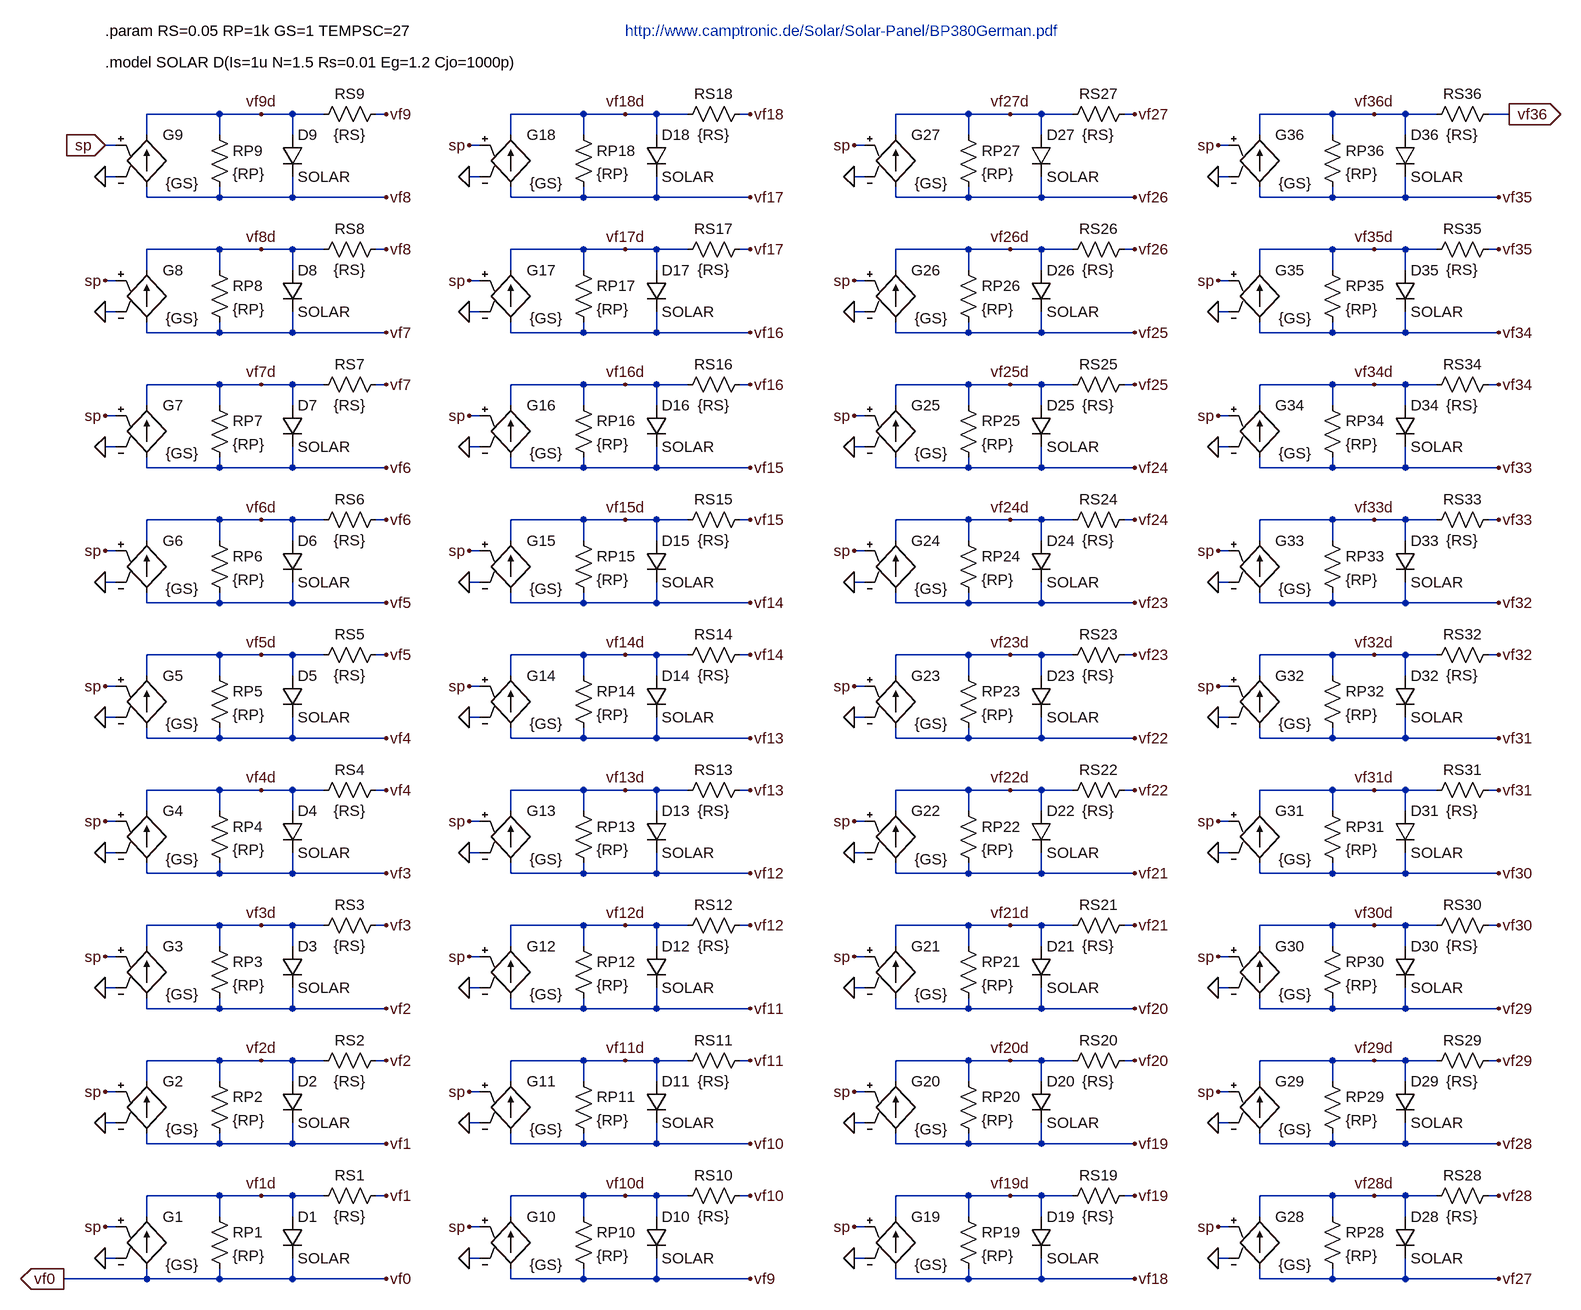
[diagram p0: schematic solar36.asc]
solar36.asc, the LTspice schematic file:
Version 4
SHEET 1 2152 2104
WIRE -1168 240 -1280 240
WIRE -1104 240 -1168 240
WIRE -1056 240 -1104 240
WIRE -1008 240 -1056 240
WIRE -912 240 -928 240
WIRE -608 240 -720 240
WIRE -544 240 -608 240
WIRE -496 240 -544 240
WIRE -448 240 -496 240
WIRE -352 240 -368 240
WIRE -16 240 -128 240
WIRE 48 240 -16 240
WIRE 96 240 48 240
WIRE 144 240 96 240
WIRE 240 240 224 240
WIRE 544 240 432 240
WIRE 608 240 544 240
WIRE 656 240 608 240
WIRE 704 240 656 240
WIRE 816 240 784 240
WIRE -1280 272 -1280 240
WIRE -1168 272 -1168 240
WIRE -1056 272 -1056 240
WIRE -720 272 -720 240
WIRE -608 272 -608 240
WIRE -496 272 -496 240
WIRE -128 272 -128 240
WIRE -16 272 -16 240
WIRE 96 272 96 240
WIRE 432 272 432 240
WIRE 544 272 544 240
WIRE 656 272 656 240
WIRE -1328 288 -1344 288
WIRE -768 288 -784 288
WIRE -176 288 -192 288
WIRE 384 288 368 288
WIRE -1328 336 -1344 336
WIRE -768 336 -784 336
WIRE -176 336 -192 336
WIRE 384 336 368 336
WIRE -1280 368 -1280 352
WIRE -1168 368 -1168 352
WIRE -1168 368 -1280 368
WIRE -1056 368 -1056 336
WIRE -1056 368 -1168 368
WIRE -912 368 -1056 368
WIRE -720 368 -720 352
WIRE -608 368 -608 352
WIRE -608 368 -720 368
WIRE -496 368 -496 336
WIRE -496 368 -608 368
WIRE -352 368 -496 368
WIRE -128 368 -128 352
WIRE -16 368 -16 352
WIRE -16 368 -128 368
WIRE 96 368 96 336
WIRE 96 368 -16 368
WIRE 240 368 96 368
WIRE 432 368 432 352
WIRE 544 368 544 352
WIRE 544 368 432 368
WIRE 656 368 656 336
WIRE 656 368 544 368
WIRE 800 368 656 368
WIRE -1168 448 -1280 448
WIRE -1104 448 -1168 448
WIRE -1056 448 -1104 448
WIRE -1008 448 -1056 448
WIRE -912 448 -928 448
WIRE -608 448 -720 448
WIRE -544 448 -608 448
WIRE -496 448 -544 448
WIRE -448 448 -496 448
WIRE -352 448 -368 448
WIRE -16 448 -128 448
WIRE 48 448 -16 448
WIRE 96 448 48 448
WIRE 144 448 96 448
WIRE 240 448 224 448
WIRE 544 448 432 448
WIRE 608 448 544 448
WIRE 656 448 608 448
WIRE 704 448 656 448
WIRE 800 448 784 448
WIRE -1280 480 -1280 448
WIRE -1168 480 -1168 448
WIRE -1056 480 -1056 448
WIRE -720 480 -720 448
WIRE -608 480 -608 448
WIRE -496 480 -496 448
WIRE -128 480 -128 448
WIRE -16 480 -16 448
WIRE 96 480 96 448
WIRE 432 480 432 448
WIRE 544 480 544 448
WIRE 656 480 656 448
WIRE -1328 496 -1344 496
WIRE -768 496 -784 496
WIRE -176 496 -192 496
WIRE 384 496 368 496
WIRE -1328 544 -1344 544
WIRE -768 544 -784 544
WIRE -176 544 -192 544
WIRE 384 544 368 544
WIRE -1280 576 -1280 560
WIRE -1168 576 -1168 560
WIRE -1168 576 -1280 576
WIRE -1056 576 -1056 544
WIRE -1056 576 -1168 576
WIRE -912 576 -1056 576
WIRE -720 576 -720 560
WIRE -608 576 -608 560
WIRE -608 576 -720 576
WIRE -496 576 -496 544
WIRE -496 576 -608 576
WIRE -352 576 -496 576
WIRE -128 576 -128 560
WIRE -16 576 -16 560
WIRE -16 576 -128 576
WIRE 96 576 96 544
WIRE 96 576 -16 576
WIRE 240 576 96 576
WIRE 432 576 432 560
WIRE 544 576 544 560
WIRE 544 576 432 576
WIRE 656 576 656 544
WIRE 656 576 544 576
WIRE 800 576 656 576
WIRE -1168 656 -1280 656
WIRE -1104 656 -1168 656
WIRE -1056 656 -1104 656
WIRE -1008 656 -1056 656
WIRE -912 656 -928 656
WIRE -608 656 -720 656
WIRE -544 656 -608 656
WIRE -496 656 -544 656
WIRE -448 656 -496 656
WIRE -352 656 -368 656
WIRE -16 656 -128 656
WIRE 48 656 -16 656
WIRE 96 656 48 656
WIRE 144 656 96 656
WIRE 240 656 224 656
WIRE 544 656 432 656
WIRE 608 656 544 656
WIRE 656 656 608 656
WIRE 704 656 656 656
WIRE 800 656 784 656
WIRE -1280 688 -1280 656
WIRE -1168 688 -1168 656
WIRE -1056 688 -1056 656
WIRE -720 688 -720 656
WIRE -608 688 -608 656
WIRE -496 688 -496 656
WIRE -128 688 -128 656
WIRE -16 688 -16 656
WIRE 96 688 96 656
WIRE 432 688 432 656
WIRE 544 688 544 656
WIRE 656 688 656 656
WIRE -1328 704 -1344 704
WIRE -768 704 -784 704
WIRE -176 704 -192 704
WIRE 384 704 368 704
WIRE -1328 752 -1344 752
WIRE -768 752 -784 752
WIRE -176 752 -192 752
WIRE 384 752 368 752
WIRE -1280 784 -1280 768
WIRE -1168 784 -1168 768
WIRE -1168 784 -1280 784
WIRE -1056 784 -1056 752
WIRE -1056 784 -1168 784
WIRE -912 784 -1056 784
WIRE -720 784 -720 768
WIRE -608 784 -608 768
WIRE -608 784 -720 784
WIRE -496 784 -496 752
WIRE -496 784 -608 784
WIRE -352 784 -496 784
WIRE -128 784 -128 768
WIRE -16 784 -16 768
WIRE -16 784 -128 784
WIRE 96 784 96 752
WIRE 96 784 -16 784
WIRE 240 784 96 784
WIRE 432 784 432 768
WIRE 544 784 544 768
WIRE 544 784 432 784
WIRE 656 784 656 752
WIRE 656 784 544 784
WIRE 800 784 656 784
WIRE -1168 864 -1280 864
WIRE -1104 864 -1168 864
WIRE -1056 864 -1104 864
WIRE -1008 864 -1056 864
WIRE -912 864 -928 864
WIRE -608 864 -720 864
WIRE -544 864 -608 864
WIRE -496 864 -544 864
WIRE -448 864 -496 864
WIRE -352 864 -368 864
WIRE -16 864 -128 864
WIRE 48 864 -16 864
WIRE 96 864 48 864
WIRE 144 864 96 864
WIRE 240 864 224 864
WIRE 544 864 432 864
WIRE 608 864 544 864
WIRE 656 864 608 864
WIRE 704 864 656 864
WIRE 800 864 784 864
WIRE -1280 896 -1280 864
WIRE -1168 896 -1168 864
WIRE -1056 896 -1056 864
WIRE -720 896 -720 864
WIRE -608 896 -608 864
WIRE -496 896 -496 864
WIRE -128 896 -128 864
WIRE -16 896 -16 864
WIRE 96 896 96 864
WIRE 432 896 432 864
WIRE 544 896 544 864
WIRE 656 896 656 864
WIRE -1328 912 -1344 912
WIRE -768 912 -784 912
WIRE -176 912 -192 912
WIRE 384 912 368 912
WIRE -1328 960 -1344 960
WIRE -768 960 -784 960
WIRE -176 960 -192 960
WIRE 384 960 368 960
WIRE -1280 992 -1280 976
WIRE -1168 992 -1168 976
WIRE -1168 992 -1280 992
WIRE -1056 992 -1056 960
WIRE -1056 992 -1168 992
WIRE -912 992 -1056 992
WIRE -720 992 -720 976
WIRE -608 992 -608 976
WIRE -608 992 -720 992
WIRE -496 992 -496 960
WIRE -496 992 -608 992
WIRE -352 992 -496 992
WIRE -128 992 -128 976
WIRE -16 992 -16 976
WIRE -16 992 -128 992
WIRE 96 992 96 960
WIRE 96 992 -16 992
WIRE 240 992 96 992
WIRE 432 992 432 976
WIRE 544 992 544 976
WIRE 544 992 432 992
WIRE 656 992 656 960
WIRE 656 992 544 992
WIRE 800 992 656 992
WIRE -1168 1072 -1280 1072
WIRE -1104 1072 -1168 1072
WIRE -1056 1072 -1104 1072
WIRE -1008 1072 -1056 1072
WIRE -912 1072 -928 1072
WIRE -608 1072 -720 1072
WIRE -544 1072 -608 1072
WIRE -496 1072 -544 1072
WIRE -448 1072 -496 1072
WIRE -352 1072 -368 1072
WIRE -16 1072 -128 1072
WIRE 48 1072 -16 1072
WIRE 96 1072 48 1072
WIRE 144 1072 96 1072
WIRE 240 1072 224 1072
WIRE 544 1072 432 1072
WIRE 608 1072 544 1072
WIRE 656 1072 608 1072
WIRE 704 1072 656 1072
WIRE 800 1072 784 1072
WIRE -1280 1104 -1280 1072
WIRE -1168 1104 -1168 1072
WIRE -1056 1104 -1056 1072
WIRE -720 1104 -720 1072
WIRE -608 1104 -608 1072
WIRE -496 1104 -496 1072
WIRE -128 1104 -128 1072
WIRE -16 1104 -16 1072
WIRE 96 1104 96 1072
WIRE 432 1104 432 1072
WIRE 544 1104 544 1072
WIRE 656 1104 656 1072
WIRE -1328 1120 -1344 1120
WIRE -768 1120 -784 1120
WIRE -176 1120 -192 1120
WIRE 384 1120 368 1120
WIRE -1328 1168 -1344 1168
WIRE -768 1168 -784 1168
WIRE -176 1168 -192 1168
WIRE 384 1168 368 1168
WIRE -1280 1200 -1280 1184
WIRE -1168 1200 -1168 1184
WIRE -1168 1200 -1280 1200
WIRE -1056 1200 -1056 1168
WIRE -1056 1200 -1168 1200
WIRE -912 1200 -1056 1200
WIRE -720 1200 -720 1184
WIRE -608 1200 -608 1184
WIRE -608 1200 -720 1200
WIRE -496 1200 -496 1168
WIRE -496 1200 -608 1200
WIRE -352 1200 -496 1200
WIRE -128 1200 -128 1184
WIRE -16 1200 -16 1184
WIRE -16 1200 -128 1200
WIRE 96 1200 96 1168
WIRE 96 1200 -16 1200
WIRE 240 1200 96 1200
WIRE 432 1200 432 1184
WIRE 544 1200 544 1184
WIRE 544 1200 432 1200
WIRE 656 1200 656 1168
WIRE 656 1200 544 1200
WIRE 800 1200 656 1200
WIRE -1168 1280 -1280 1280
WIRE -1104 1280 -1168 1280
WIRE -1056 1280 -1104 1280
WIRE -1008 1280 -1056 1280
WIRE -912 1280 -928 1280
WIRE -608 1280 -720 1280
WIRE -544 1280 -608 1280
WIRE -496 1280 -544 1280
WIRE -448 1280 -496 1280
WIRE -352 1280 -368 1280
WIRE -16 1280 -128 1280
WIRE 48 1280 -16 1280
WIRE 96 1280 48 1280
WIRE 144 1280 96 1280
WIRE 240 1280 224 1280
WIRE 544 1280 432 1280
WIRE 608 1280 544 1280
WIRE 656 1280 608 1280
WIRE 704 1280 656 1280
WIRE 800 1280 784 1280
WIRE -1280 1312 -1280 1280
WIRE -1168 1312 -1168 1280
WIRE -1056 1312 -1056 1280
WIRE -720 1312 -720 1280
WIRE -608 1312 -608 1280
WIRE -496 1312 -496 1280
WIRE -128 1312 -128 1280
WIRE -16 1312 -16 1280
WIRE 96 1312 96 1280
WIRE 432 1312 432 1280
WIRE 544 1312 544 1280
WIRE 656 1312 656 1280
WIRE -1328 1328 -1344 1328
WIRE -768 1328 -784 1328
WIRE -176 1328 -192 1328
WIRE 384 1328 368 1328
WIRE -1328 1376 -1344 1376
WIRE -768 1376 -784 1376
WIRE -176 1376 -192 1376
WIRE 384 1376 368 1376
WIRE -1280 1408 -1280 1392
WIRE -1168 1408 -1168 1392
WIRE -1168 1408 -1280 1408
WIRE -1056 1408 -1056 1376
WIRE -1056 1408 -1168 1408
WIRE -912 1408 -1056 1408
WIRE -720 1408 -720 1392
WIRE -608 1408 -608 1392
WIRE -608 1408 -720 1408
WIRE -496 1408 -496 1376
WIRE -496 1408 -608 1408
WIRE -352 1408 -496 1408
WIRE -128 1408 -128 1392
WIRE -16 1408 -16 1392
WIRE -16 1408 -128 1408
WIRE 96 1408 96 1376
WIRE 96 1408 -16 1408
WIRE 240 1408 96 1408
WIRE 432 1408 432 1392
WIRE 544 1408 544 1392
WIRE 544 1408 432 1408
WIRE 656 1408 656 1376
WIRE 656 1408 544 1408
WIRE 800 1408 656 1408
WIRE -1168 1488 -1280 1488
WIRE -1104 1488 -1168 1488
WIRE -1056 1488 -1104 1488
WIRE -1008 1488 -1056 1488
WIRE -912 1488 -928 1488
WIRE -608 1488 -720 1488
WIRE -544 1488 -608 1488
WIRE -496 1488 -544 1488
WIRE -448 1488 -496 1488
WIRE -352 1488 -368 1488
WIRE -16 1488 -128 1488
WIRE 48 1488 -16 1488
WIRE 96 1488 48 1488
WIRE 144 1488 96 1488
WIRE 240 1488 224 1488
WIRE 544 1488 432 1488
WIRE 608 1488 544 1488
WIRE 656 1488 608 1488
WIRE 704 1488 656 1488
WIRE 800 1488 784 1488
WIRE -1280 1520 -1280 1488
WIRE -1168 1520 -1168 1488
WIRE -1056 1520 -1056 1488
WIRE -720 1520 -720 1488
WIRE -608 1520 -608 1488
WIRE -496 1520 -496 1488
WIRE -128 1520 -128 1488
WIRE -16 1520 -16 1488
WIRE 96 1520 96 1488
WIRE 432 1520 432 1488
WIRE 544 1520 544 1488
WIRE 656 1520 656 1488
WIRE -1328 1536 -1344 1536
WIRE -768 1536 -784 1536
WIRE -176 1536 -192 1536
WIRE 384 1536 368 1536
WIRE -1328 1584 -1344 1584
WIRE -768 1584 -784 1584
WIRE -176 1584 -192 1584
WIRE 384 1584 368 1584
WIRE -1280 1616 -1280 1600
WIRE -1168 1616 -1168 1600
WIRE -1168 1616 -1280 1616
WIRE -1056 1616 -1056 1584
WIRE -1056 1616 -1168 1616
WIRE -912 1616 -1056 1616
WIRE -720 1616 -720 1600
WIRE -608 1616 -608 1600
WIRE -608 1616 -720 1616
WIRE -496 1616 -496 1584
WIRE -496 1616 -608 1616
WIRE -352 1616 -496 1616
WIRE -128 1616 -128 1600
WIRE -16 1616 -16 1600
WIRE -16 1616 -128 1616
WIRE 96 1616 96 1584
WIRE 96 1616 -16 1616
WIRE 240 1616 96 1616
WIRE 432 1616 432 1600
WIRE 544 1616 544 1600
WIRE 544 1616 432 1616
WIRE 656 1616 656 1584
WIRE 656 1616 544 1616
WIRE 800 1616 656 1616
WIRE -1168 1696 -1280 1696
WIRE -1104 1696 -1168 1696
WIRE -1056 1696 -1104 1696
WIRE -1008 1696 -1056 1696
WIRE -912 1696 -928 1696
WIRE -608 1696 -720 1696
WIRE -544 1696 -608 1696
WIRE -496 1696 -544 1696
WIRE -448 1696 -496 1696
WIRE -352 1696 -368 1696
WIRE -16 1696 -128 1696
WIRE 48 1696 -16 1696
WIRE 96 1696 48 1696
WIRE 144 1696 96 1696
WIRE 240 1696 224 1696
WIRE 544 1696 432 1696
WIRE 608 1696 544 1696
WIRE 656 1696 608 1696
WIRE 704 1696 656 1696
WIRE 800 1696 784 1696
WIRE -1280 1728 -1280 1696
WIRE -1168 1728 -1168 1696
WIRE -1056 1728 -1056 1696
WIRE -720 1728 -720 1696
WIRE -608 1728 -608 1696
WIRE -496 1728 -496 1696
WIRE -128 1728 -128 1696
WIRE -16 1728 -16 1696
WIRE 96 1728 96 1696
WIRE 432 1728 432 1696
WIRE 544 1728 544 1696
WIRE 656 1728 656 1696
WIRE -1328 1744 -1344 1744
WIRE -768 1744 -784 1744
WIRE -176 1744 -192 1744
WIRE 384 1744 368 1744
WIRE -1328 1792 -1344 1792
WIRE -768 1792 -784 1792
WIRE -176 1792 -192 1792
WIRE 384 1792 368 1792
WIRE -1280 1824 -1280 1808
WIRE -1168 1824 -1168 1808
WIRE -1168 1824 -1280 1824
WIRE -1056 1824 -1056 1792
WIRE -1056 1824 -1168 1824
WIRE -912 1824 -1056 1824
WIRE -720 1824 -720 1808
WIRE -608 1824 -608 1808
WIRE -608 1824 -720 1824
WIRE -496 1824 -496 1792
WIRE -496 1824 -608 1824
WIRE -352 1824 -496 1824
WIRE -128 1824 -128 1808
WIRE -16 1824 -16 1808
WIRE -16 1824 -128 1824
WIRE 96 1824 96 1792
WIRE 96 1824 -16 1824
WIRE 240 1824 96 1824
WIRE 432 1824 432 1808
WIRE 544 1824 544 1808
WIRE 544 1824 432 1824
WIRE 656 1824 656 1792
WIRE 656 1824 544 1824
WIRE 800 1824 656 1824
WIRE -1168 1904 -1280 1904
WIRE -1104 1904 -1168 1904
WIRE -1056 1904 -1104 1904
WIRE -1008 1904 -1056 1904
WIRE -912 1904 -928 1904
WIRE -608 1904 -720 1904
WIRE -544 1904 -608 1904
WIRE -496 1904 -544 1904
WIRE -448 1904 -496 1904
WIRE -352 1904 -368 1904
WIRE -16 1904 -128 1904
WIRE 48 1904 -16 1904
WIRE 96 1904 48 1904
WIRE 144 1904 96 1904
WIRE 240 1904 224 1904
WIRE 544 1904 432 1904
WIRE 608 1904 544 1904
WIRE 656 1904 608 1904
WIRE 704 1904 656 1904
WIRE 800 1904 784 1904
WIRE -1280 1936 -1280 1904
WIRE -1168 1936 -1168 1904
WIRE -1056 1936 -1056 1904
WIRE -720 1936 -720 1904
WIRE -608 1936 -608 1904
WIRE -496 1936 -496 1904
WIRE -128 1936 -128 1904
WIRE -16 1936 -16 1904
WIRE 96 1936 96 1904
WIRE 432 1936 432 1904
WIRE 544 1936 544 1904
WIRE 656 1936 656 1904
WIRE -1328 1952 -1344 1952
WIRE -768 1952 -784 1952
WIRE -176 1952 -192 1952
WIRE 384 1952 368 1952
WIRE -1328 2000 -1344 2000
WIRE -768 2000 -784 2000
WIRE -176 2000 -192 2000
WIRE 384 2000 368 2000
WIRE -1280 2032 -1280 2016
WIRE -1280 2032 -1408 2032
WIRE -1168 2032 -1168 2016
WIRE -1168 2032 -1280 2032
WIRE -1056 2032 -1056 2000
WIRE -1056 2032 -1168 2032
WIRE -912 2032 -1056 2032
WIRE -720 2032 -720 2016
WIRE -608 2032 -608 2016
WIRE -608 2032 -720 2032
WIRE -496 2032 -496 2000
WIRE -496 2032 -608 2032
WIRE -352 2032 -496 2032
WIRE -128 2032 -128 2016
WIRE -16 2032 -16 2016
WIRE -16 2032 -128 2032
WIRE 96 2032 96 2000
WIRE 96 2032 -16 2032
WIRE 240 2032 96 2032
WIRE 432 2032 432 2016
WIRE 544 2032 544 2016
WIRE 544 2032 432 2032
WIRE 656 2032 656 2000
WIRE 656 2032 544 2032
WIRE 800 2032 656 2032
FLAG -912 240 vf9
FLAG -1344 336 0
FLAG -1344 288 sp
IOPIN -1344 288 In
FLAG -912 368 vf8
FLAG -912 448 vf8
FLAG -1344 544 0
FLAG -1344 496 sp
FLAG -912 576 vf7
FLAG -912 656 vf7
FLAG -1344 752 0
FLAG -1344 704 sp
FLAG -912 784 vf6
FLAG -912 864 vf6
FLAG -1344 960 0
FLAG -1344 912 sp
FLAG -912 992 vf5
FLAG -352 240 vf18
FLAG -784 336 0
FLAG -784 288 sp
FLAG -352 368 vf17
FLAG -352 448 vf17
FLAG -784 544 0
FLAG -784 496 sp
FLAG -352 576 vf16
FLAG -352 656 vf16
FLAG -784 752 0
FLAG -784 704 sp
FLAG -352 784 vf15
FLAG -352 864 vf15
FLAG -784 960 0
FLAG -784 912 sp
FLAG -352 992 vf14
FLAG -912 1072 vf5
FLAG -1344 1168 0
FLAG -1344 1120 sp
FLAG -912 1200 vf4
FLAG -912 1280 vf4
FLAG -1344 1376 0
FLAG -1344 1328 sp
FLAG -912 1408 vf3
FLAG -912 1488 vf3
FLAG -1344 1584 0
FLAG -1344 1536 sp
FLAG -912 1616 vf2
FLAG -912 1696 vf2
FLAG -1344 1792 0
FLAG -1344 1744 sp
FLAG -912 1824 vf1
FLAG -352 1072 vf14
FLAG -784 1168 0
FLAG -784 1120 sp
FLAG -352 1200 vf13
FLAG -352 1280 vf13
FLAG -784 1376 0
FLAG -784 1328 sp
FLAG -352 1408 vf12
FLAG -352 1488 vf12
FLAG -784 1584 0
FLAG -784 1536 sp
FLAG -352 1616 vf11
FLAG -352 1696 vf11
FLAG -784 1792 0
FLAG -784 1744 sp
FLAG -352 1824 vf10
FLAG 240 240 vf27
FLAG -192 336 0
FLAG -192 288 sp
FLAG 240 368 vf26
FLAG 240 448 vf26
FLAG -192 544 0
FLAG -192 496 sp
FLAG 240 576 vf25
FLAG 240 656 vf25
FLAG -192 752 0
FLAG -192 704 sp
FLAG 240 784 vf24
FLAG 240 864 vf24
FLAG -192 960 0
FLAG -192 912 sp
FLAG 240 992 vf23
FLAG 816 240 vf36
IOPIN 816 240 Out
FLAG 368 336 0
FLAG 368 288 sp
FLAG 800 368 vf35
FLAG 800 448 vf35
FLAG 368 544 0
FLAG 368 496 sp
FLAG 800 576 vf34
FLAG 800 656 vf34
FLAG 368 752 0
FLAG 368 704 sp
FLAG 800 784 vf33
FLAG 800 864 vf33
FLAG 368 960 0
FLAG 368 912 sp
FLAG 800 992 vf32
FLAG 240 1072 vf23
FLAG -192 1168 0
FLAG -192 1120 sp
FLAG 240 1200 vf22
FLAG 240 1280 vf22
FLAG -192 1376 0
FLAG -192 1328 sp
FLAG 240 1408 vf21
FLAG 240 1488 vf21
FLAG -192 1584 0
FLAG -192 1536 sp
FLAG 240 1616 vf20
FLAG 240 1696 vf20
FLAG -192 1792 0
FLAG -192 1744 sp
FLAG 240 1824 vf19
FLAG 800 1072 vf32
FLAG 368 1168 0
FLAG 368 1120 sp
FLAG 800 1200 vf31
FLAG 800 1280 vf31
FLAG 368 1376 0
FLAG 368 1328 sp
FLAG 800 1408 vf30
FLAG 800 1488 vf30
FLAG 368 1584 0
FLAG 368 1536 sp
FLAG 800 1616 vf29
FLAG 800 1696 vf29
FLAG 368 1792 0
FLAG 368 1744 sp
FLAG 800 1824 vf28
FLAG -912 1904 vf1
FLAG -1344 2000 0
FLAG -1344 1952 sp
FLAG -912 2032 vf0
FLAG -352 1904 vf10
FLAG -784 2000 0
FLAG -784 1952 sp
FLAG -352 2032 vf9
FLAG 240 1904 vf19
FLAG -192 2000 0
FLAG -192 1952 sp
FLAG 240 2032 vf18
FLAG 800 1904 vf28
FLAG 368 2000 0
FLAG 368 1952 sp
FLAG 800 2032 vf27
FLAG -1104 240 vf9d
FLAG -1104 448 vf8d
FLAG -1104 656 vf7d
FLAG -1104 864 vf6d
FLAG -1104 1072 vf5d
FLAG -1104 1280 vf4d
FLAG -1104 1488 vf3d
FLAG -1104 1696 vf2d
FLAG -1104 1904 vf1d
FLAG -544 1904 vf10d
FLAG -544 1696 vf11d
FLAG -544 1488 vf12d
FLAG -544 1280 vf13d
FLAG -544 1072 vf14d
FLAG -544 864 vf15d
FLAG -544 656 vf16d
FLAG -544 448 vf17d
FLAG -544 240 vf18d
FLAG 48 1904 vf19d
FLAG 48 1696 vf20d
FLAG 48 1488 vf21d
FLAG 48 1280 vf22d
FLAG 48 1072 vf23d
FLAG 48 864 vf24d
FLAG 48 656 vf25d
FLAG 608 1904 vf28d
FLAG 608 1696 vf29d
FLAG 608 1488 vf30d
FLAG 608 1280 vf31d
FLAG 608 1072 vf32d
FLAG 48 448 vf26d
FLAG 48 240 vf27d
FLAG 608 240 vf36d
FLAG 608 448 vf35d
FLAG 608 656 vf34d
FLAG 608 864 vf33d
FLAG -1408 2032 vf0
IOPIN -1408 2032 Out
SYMBOL diode -1072 272 R0
SYMATTR InstName D9
SYMATTR Value SOLAR
SYMATTR SpiceLine TEMP={TEMPSC}
SYMBOL res -1184 256 R0
SYMATTR InstName RP9
SYMATTR Value {RP}
SYMBOL g -1280 256 R0
WINDOW 3 29 90 Left 0
SYMATTR Value {GS}
SYMATTR InstName G9
SYMBOL res -1024 256 R270
WINDOW 0 32 56 VTop 0
WINDOW 3 0 56 VBottom 0
SYMATTR InstName RS9
SYMATTR Value {RS}
SYMBOL diode -1072 480 R0
SYMATTR InstName D8
SYMATTR Value SOLAR
SYMATTR SpiceLine TEMP={TEMPSC}
SYMBOL res -1184 464 R0
SYMATTR InstName RP8
SYMATTR Value {RP}
SYMBOL g -1280 464 R0
WINDOW 3 29 90 Left 0
SYMATTR Value {GS}
SYMATTR InstName G8
SYMBOL res -1024 464 R270
WINDOW 0 32 56 VTop 0
WINDOW 3 0 56 VBottom 0
SYMATTR InstName RS8
SYMATTR Value {RS}
SYMBOL diode -1072 688 R0
SYMATTR InstName D7
SYMATTR Value SOLAR
SYMATTR SpiceLine TEMP={TEMPSC}
SYMBOL res -1184 672 R0
SYMATTR InstName RP7
SYMATTR Value {RP}
SYMBOL g -1280 672 R0
WINDOW 3 29 90 Left 0
SYMATTR Value {GS}
SYMATTR InstName G7
SYMBOL res -1024 672 R270
WINDOW 0 32 56 VTop 0
WINDOW 3 0 56 VBottom 0
SYMATTR InstName RS7
SYMATTR Value {RS}
SYMBOL diode -1072 896 R0
SYMATTR InstName D6
SYMATTR Value SOLAR
SYMATTR SpiceLine TEMP={TEMPSC}
SYMBOL res -1184 880 R0
SYMATTR InstName RP6
SYMATTR Value {RP}
SYMBOL g -1280 880 R0
WINDOW 3 29 90 Left 0
SYMATTR Value {GS}
SYMATTR InstName G6
SYMBOL res -1024 880 R270
WINDOW 0 32 56 VTop 0
WINDOW 3 0 56 VBottom 0
SYMATTR InstName RS6
SYMATTR Value {RS}
SYMBOL diode -512 272 R0
SYMATTR InstName D18
SYMATTR Value SOLAR
SYMATTR SpiceLine TEMP={TEMPSC}
SYMBOL res -624 256 R0
SYMATTR InstName RP18
SYMATTR Value {RP}
SYMBOL g -720 256 R0
WINDOW 3 29 90 Left 0
SYMATTR Value {GS}
SYMATTR InstName G18
SYMBOL res -464 256 R270
WINDOW 0 32 56 VTop 0
WINDOW 3 0 56 VBottom 0
SYMATTR InstName RS18
SYMATTR Value {RS}
SYMBOL diode -512 480 R0
SYMATTR InstName D17
SYMATTR Value SOLAR
SYMATTR SpiceLine TEMP={TEMPSC}
SYMBOL res -624 464 R0
SYMATTR InstName RP17
SYMATTR Value {RP}
SYMBOL g -720 464 R0
WINDOW 3 29 90 Left 0
SYMATTR Value {GS}
SYMATTR InstName G17
SYMBOL res -464 464 R270
WINDOW 0 32 56 VTop 0
WINDOW 3 0 56 VBottom 0
SYMATTR InstName RS17
SYMATTR Value {RS}
SYMBOL diode -512 688 R0
SYMATTR InstName D16
SYMATTR Value SOLAR
SYMATTR SpiceLine TEMP={TEMPSC}
SYMBOL res -624 672 R0
SYMATTR InstName RP16
SYMATTR Value {RP}
SYMBOL g -720 672 R0
WINDOW 3 29 90 Left 0
SYMATTR Value {GS}
SYMATTR InstName G16
SYMBOL res -464 672 R270
WINDOW 0 32 56 VTop 0
WINDOW 3 0 56 VBottom 0
SYMATTR InstName RS16
SYMATTR Value {RS}
SYMBOL diode -512 896 R0
SYMATTR InstName D15
SYMATTR Value SOLAR
SYMATTR SpiceLine TEMP={TEMPSC}
SYMBOL res -624 880 R0
SYMATTR InstName RP15
SYMATTR Value {RP}
SYMBOL g -720 880 R0
WINDOW 3 29 90 Left 0
SYMATTR Value {GS}
SYMATTR InstName G15
SYMBOL res -464 880 R270
WINDOW 0 32 56 VTop 0
WINDOW 3 0 56 VBottom 0
SYMATTR InstName RS15
SYMATTR Value {RS}
SYMBOL diode -1072 1104 R0
SYMATTR InstName D5
SYMATTR Value SOLAR
SYMATTR SpiceLine TEMP={TEMPSC}
SYMBOL res -1184 1088 R0
SYMATTR InstName RP5
SYMATTR Value {RP}
SYMBOL g -1280 1088 R0
WINDOW 3 29 90 Left 0
SYMATTR Value {GS}
SYMATTR InstName G5
SYMBOL res -1024 1088 R270
WINDOW 0 32 56 VTop 0
WINDOW 3 0 56 VBottom 0
SYMATTR InstName RS5
SYMATTR Value {RS}
SYMBOL diode -1072 1312 R0
SYMATTR InstName D4
SYMATTR Value SOLAR
SYMATTR SpiceLine TEMP={TEMPSC}
SYMBOL res -1184 1296 R0
SYMATTR InstName RP4
SYMATTR Value {RP}
SYMBOL g -1280 1296 R0
WINDOW 3 29 90 Left 0
SYMATTR Value {GS}
SYMATTR InstName G4
SYMBOL res -1024 1296 R270
WINDOW 0 32 56 VTop 0
WINDOW 3 0 56 VBottom 0
SYMATTR InstName RS4
SYMATTR Value {RS}
SYMBOL diode -1072 1520 R0
SYMATTR InstName D3
SYMATTR Value SOLAR
SYMATTR SpiceLine TEMP={TEMPSC}
SYMBOL res -1184 1504 R0
SYMATTR InstName RP3
SYMATTR Value {RP}
SYMBOL g -1280 1504 R0
WINDOW 3 29 90 Left 0
SYMATTR Value {GS}
SYMATTR InstName G3
SYMBOL res -1024 1504 R270
WINDOW 0 32 56 VTop 0
WINDOW 3 0 56 VBottom 0
SYMATTR InstName RS3
SYMATTR Value {RS}
SYMBOL diode -1072 1728 R0
SYMATTR InstName D2
SYMATTR Value SOLAR
SYMATTR SpiceLine TEMP={TEMPSC}
SYMBOL res -1184 1712 R0
SYMATTR InstName RP2
SYMATTR Value {RP}
SYMBOL g -1280 1712 R0
WINDOW 3 29 90 Left 0
SYMATTR Value {GS}
SYMATTR InstName G2
SYMBOL res -1024 1712 R270
WINDOW 0 32 56 VTop 0
WINDOW 3 0 56 VBottom 0
SYMATTR InstName RS2
SYMATTR Value {RS}
SYMBOL diode -512 1104 R0
SYMATTR InstName D14
SYMATTR Value SOLAR
SYMATTR SpiceLine TEMP={TEMPSC}
SYMBOL res -624 1088 R0
SYMATTR InstName RP14
SYMATTR Value {RP}
SYMBOL g -720 1088 R0
WINDOW 3 29 90 Left 0
SYMATTR Value {GS}
SYMATTR InstName G14
SYMBOL res -464 1088 R270
WINDOW 0 32 56 VTop 0
WINDOW 3 0 56 VBottom 0
SYMATTR InstName RS14
SYMATTR Value {RS}
SYMBOL diode -512 1312 R0
SYMATTR InstName D13
SYMATTR Value SOLAR
SYMATTR SpiceLine TEMP={TEMPSC}
SYMBOL res -624 1296 R0
SYMATTR InstName RP13
SYMATTR Value {RP}
SYMBOL g -720 1296 R0
WINDOW 3 29 90 Left 0
SYMATTR Value {GS}
SYMATTR InstName G13
SYMBOL res -464 1296 R270
WINDOW 0 32 56 VTop 0
WINDOW 3 0 56 VBottom 0
SYMATTR InstName RS13
SYMATTR Value {RS}
SYMBOL diode -512 1520 R0
SYMATTR InstName D12
SYMATTR Value SOLAR
SYMATTR SpiceLine TEMP={TEMPSC}
SYMBOL res -624 1504 R0
SYMATTR InstName RP12
SYMATTR Value {RP}
SYMBOL g -720 1504 R0
WINDOW 3 29 90 Left 0
SYMATTR Value {GS}
SYMATTR InstName G12
SYMBOL res -464 1504 R270
WINDOW 0 32 56 VTop 0
WINDOW 3 0 56 VBottom 0
SYMATTR InstName RS12
SYMATTR Value {RS}
SYMBOL diode -512 1728 R0
SYMATTR InstName D11
SYMATTR Value SOLAR
SYMATTR SpiceLine TEMP={TEMPSC}
SYMBOL res -624 1712 R0
SYMATTR InstName RP11
SYMATTR Value {RP}
SYMBOL g -720 1712 R0
WINDOW 3 29 90 Left 0
SYMATTR Value {GS}
SYMATTR InstName G11
SYMBOL res -464 1712 R270
WINDOW 0 32 56 VTop 0
WINDOW 3 0 56 VBottom 0
SYMATTR InstName RS11
SYMATTR Value {RS}
SYMBOL diode 80 272 R0
SYMATTR InstName D27
SYMATTR Value SOLAR
SYMATTR SpiceLine TEMP={TEMPSC}
SYMBOL res -32 256 R0
SYMATTR InstName RP27
SYMATTR Value {RP}
SYMBOL g -128 256 R0
WINDOW 3 29 90 Left 0
SYMATTR Value {GS}
SYMATTR InstName G27
SYMBOL res 128 256 R270
WINDOW 0 32 56 VTop 0
WINDOW 3 0 56 VBottom 0
SYMATTR InstName RS27
SYMATTR Value {RS}
SYMBOL diode 80 480 R0
SYMATTR InstName D26
SYMATTR Value SOLAR
SYMATTR SpiceLine TEMP={TEMPSC}
SYMBOL res -32 464 R0
SYMATTR InstName RP26
SYMATTR Value {RP}
SYMBOL g -128 464 R0
WINDOW 3 29 90 Left 0
SYMATTR Value {GS}
SYMATTR InstName G26
SYMBOL res 128 464 R270
WINDOW 0 32 56 VTop 0
WINDOW 3 0 56 VBottom 0
SYMATTR InstName RS26
SYMATTR Value {RS}
SYMBOL diode 80 688 R0
SYMATTR InstName D25
SYMATTR Value SOLAR
SYMATTR SpiceLine TEMP={TEMPSC}
SYMBOL res -32 672 R0
SYMATTR InstName RP25
SYMATTR Value {RP}
SYMBOL g -128 672 R0
WINDOW 3 29 90 Left 0
SYMATTR Value {GS}
SYMATTR InstName G25
SYMBOL res 128 672 R270
WINDOW 0 32 56 VTop 0
WINDOW 3 0 56 VBottom 0
SYMATTR InstName RS25
SYMATTR Value {RS}
SYMBOL diode 80 896 R0
SYMATTR InstName D24
SYMATTR Value SOLAR
SYMATTR SpiceLine TEMP={TEMPSC}
SYMBOL res -32 880 R0
SYMATTR InstName RP24
SYMATTR Value {RP}
SYMBOL g -128 880 R0
WINDOW 3 29 90 Left 0
SYMATTR Value {GS}
SYMATTR InstName G24
SYMBOL res 128 880 R270
WINDOW 0 32 56 VTop 0
WINDOW 3 0 56 VBottom 0
SYMATTR InstName RS24
SYMATTR Value {RS}
SYMBOL diode 640 272 R0
SYMATTR InstName D36
SYMATTR Value SOLAR
SYMATTR SpiceLine TEMP={TEMPSC}
SYMBOL res 528 256 R0
SYMATTR InstName RP36
SYMATTR Value {RP}
SYMBOL g 432 256 R0
WINDOW 3 29 90 Left 0
SYMATTR Value {GS}
SYMATTR InstName G36
SYMBOL res 688 256 R270
WINDOW 0 32 56 VTop 0
WINDOW 3 0 56 VBottom 0
SYMATTR InstName RS36
SYMATTR Value {RS}
SYMBOL diode 640 480 R0
SYMATTR InstName D35
SYMATTR Value SOLAR
SYMATTR SpiceLine TEMP={TEMPSC}
SYMBOL res 528 464 R0
SYMATTR InstName RP35
SYMATTR Value {RP}
SYMBOL g 432 464 R0
WINDOW 3 29 90 Left 0
SYMATTR Value {GS}
SYMATTR InstName G35
SYMBOL res 688 464 R270
WINDOW 0 32 56 VTop 0
WINDOW 3 0 56 VBottom 0
SYMATTR InstName RS35
SYMATTR Value {RS}
SYMBOL diode 640 688 R0
SYMATTR InstName D34
SYMATTR Value SOLAR
SYMATTR SpiceLine TEMP={TEMPSC}
SYMBOL res 528 672 R0
SYMATTR InstName RP34
SYMATTR Value {RP}
SYMBOL g 432 672 R0
WINDOW 3 29 90 Left 0
SYMATTR Value {GS}
SYMATTR InstName G34
SYMBOL res 688 672 R270
WINDOW 0 32 56 VTop 0
WINDOW 3 0 56 VBottom 0
SYMATTR InstName RS34
SYMATTR Value {RS}
SYMBOL diode 640 896 R0
SYMATTR InstName D33
SYMATTR Value SOLAR
SYMATTR SpiceLine TEMP={TEMPSC}
SYMBOL res 528 880 R0
SYMATTR InstName RP33
SYMATTR Value {RP}
SYMBOL g 432 880 R0
WINDOW 3 29 90 Left 0
SYMATTR Value {GS}
SYMATTR InstName G33
SYMBOL res 688 880 R270
WINDOW 0 32 56 VTop 0
WINDOW 3 0 56 VBottom 0
SYMATTR InstName RS33
SYMATTR Value {RS}
SYMBOL diode 80 1104 R0
SYMATTR InstName D23
SYMATTR Value SOLAR
SYMATTR SpiceLine TEMP={TEMPSC}
SYMBOL res -32 1088 R0
SYMATTR InstName RP23
SYMATTR Value {RP}
SYMBOL g -128 1088 R0
WINDOW 3 29 90 Left 0
SYMATTR Value {GS}
SYMATTR InstName G23
SYMBOL res 128 1088 R270
WINDOW 0 32 56 VTop 0
WINDOW 3 0 56 VBottom 0
SYMATTR InstName RS23
SYMATTR Value {RS}
SYMBOL diode 80 1312 R0
SYMATTR InstName D22
SYMATTR Value SOLAR
SYMATTR SpiceLine TEMP={TEMPSC}
SYMBOL res -32 1296 R0
SYMATTR InstName RP22
SYMATTR Value {RP}
SYMBOL g -128 1296 R0
WINDOW 3 29 90 Left 0
SYMATTR Value {GS}
SYMATTR InstName G22
SYMBOL res 128 1296 R270
WINDOW 0 32 56 VTop 0
WINDOW 3 0 56 VBottom 0
SYMATTR InstName RS22
SYMATTR Value {RS}
SYMBOL diode 80 1520 R0
SYMATTR InstName D21
SYMATTR Value SOLAR
SYMATTR SpiceLine TEMP={TEMPSC}
SYMBOL res -32 1504 R0
SYMATTR InstName RP21
SYMATTR Value {RP}
SYMBOL g -128 1504 R0
WINDOW 3 29 90 Left 0
SYMATTR Value {GS}
SYMATTR InstName G21
SYMBOL res 128 1504 R270
WINDOW 0 32 56 VTop 0
WINDOW 3 0 56 VBottom 0
SYMATTR InstName RS21
SYMATTR Value {RS}
SYMBOL diode 80 1728 R0
SYMATTR InstName D20
SYMATTR Value SOLAR
SYMATTR SpiceLine TEMP={TEMPSC}
SYMBOL res -32 1712 R0
SYMATTR InstName RP20
SYMATTR Value {RP}
SYMBOL g -128 1712 R0
WINDOW 3 29 90 Left 0
SYMATTR Value {GS}
SYMATTR InstName G20
SYMBOL res 128 1712 R270
WINDOW 0 32 56 VTop 0
WINDOW 3 0 56 VBottom 0
SYMATTR InstName RS20
SYMATTR Value {RS}
SYMBOL diode 640 1104 R0
SYMATTR InstName D32
SYMATTR Value SOLAR
SYMATTR SpiceLine TEMP={TEMPSC}
SYMBOL res 528 1088 R0
SYMATTR InstName RP32
SYMATTR Value {RP}
SYMBOL g 432 1088 R0
WINDOW 3 29 90 Left 0
SYMATTR Value {GS}
SYMATTR InstName G32
SYMBOL res 688 1088 R270
WINDOW 0 32 56 VTop 0
WINDOW 3 0 56 VBottom 0
SYMATTR InstName RS32
SYMATTR Value {RS}
SYMBOL diode 640 1312 R0
SYMATTR InstName D31
SYMATTR Value SOLAR
SYMATTR SpiceLine TEMP={TEMPSC}
SYMBOL res 528 1296 R0
SYMATTR InstName RP31
SYMATTR Value {RP}
SYMBOL g 432 1296 R0
WINDOW 3 29 90 Left 0
SYMATTR Value {GS}
SYMATTR InstName G31
SYMBOL res 688 1296 R270
WINDOW 0 32 56 VTop 0
WINDOW 3 0 56 VBottom 0
SYMATTR InstName RS31
SYMATTR Value {RS}
SYMBOL diode 640 1520 R0
SYMATTR InstName D30
SYMATTR Value SOLAR
SYMATTR SpiceLine TEMP={TEMPSC}
SYMBOL res 528 1504 R0
SYMATTR InstName RP30
SYMATTR Value {RP}
SYMBOL g 432 1504 R0
WINDOW 3 29 90 Left 0
SYMATTR Value {GS}
SYMATTR InstName G30
SYMBOL res 688 1504 R270
WINDOW 0 32 56 VTop 0
WINDOW 3 0 56 VBottom 0
SYMATTR InstName RS30
SYMATTR Value {RS}
SYMBOL diode 640 1728 R0
SYMATTR InstName D29
SYMATTR Value SOLAR
SYMATTR SpiceLine TEMP={TEMPSC}
SYMBOL res 528 1712 R0
SYMATTR InstName RP29
SYMATTR Value {RP}
SYMBOL g 432 1712 R0
WINDOW 3 29 90 Left 0
SYMATTR Value {GS}
SYMATTR InstName G29
SYMBOL res 688 1712 R270
WINDOW 0 32 56 VTop 0
WINDOW 3 0 56 VBottom 0
SYMATTR InstName RS29
SYMATTR Value {RS}
SYMBOL diode -1072 1936 R0
SYMATTR InstName D1
SYMATTR Value SOLAR
SYMATTR SpiceLine TEMP={TEMPSC}
SYMBOL res -1184 1920 R0
SYMATTR InstName RP1
SYMATTR Value {RP}
SYMBOL g -1280 1920 R0
WINDOW 3 29 90 Left 0
SYMATTR Value {GS}
SYMATTR InstName G1
SYMBOL res -1024 1920 R270
WINDOW 0 32 56 VTop 0
WINDOW 3 0 56 VBottom 0
SYMATTR InstName RS1
SYMATTR Value {RS}
SYMBOL diode -512 1936 R0
SYMATTR InstName D10
SYMATTR Value SOLAR
SYMATTR SpiceLine TEMP={TEMPSC}
SYMBOL res -624 1920 R0
SYMATTR InstName RP10
SYMATTR Value {RP}
SYMBOL g -720 1920 R0
WINDOW 3 29 90 Left 0
SYMATTR Value {GS}
SYMATTR InstName G10
SYMBOL res -464 1920 R270
WINDOW 0 32 56 VTop 0
WINDOW 3 0 56 VBottom 0
SYMATTR InstName RS10
SYMATTR Value {RS}
SYMBOL diode 80 1936 R0
SYMATTR InstName D19
SYMATTR Value SOLAR
SYMATTR SpiceLine TEMP={TEMPSC}
SYMBOL res -32 1920 R0
SYMATTR InstName RP19
SYMATTR Value {RP}
SYMBOL g -128 1920 R0
WINDOW 3 29 90 Left 0
SYMATTR Value {GS}
SYMATTR InstName G19
SYMBOL res 128 1920 R270
WINDOW 0 32 56 VTop 0
WINDOW 3 0 56 VBottom 0
SYMATTR InstName RS19
SYMATTR Value {RS}
SYMBOL diode 640 1936 R0
SYMATTR InstName D28
SYMATTR Value SOLAR
SYMATTR SpiceLine TEMP={TEMPSC}
SYMBOL res 528 1920 R0
SYMATTR InstName RP28
SYMATTR Value {RP}
SYMBOL g 432 1920 R0
WINDOW 3 29 90 Left 0
SYMATTR Value {GS}
SYMATTR InstName G28
SYMBOL res 688 1920 R270
WINDOW 0 32 56 VTop 0
WINDOW 3 0 56 VBottom 0
SYMATTR InstName RS28
SYMATTR Value {RS}
TEXT -1344 160 Left 0 !.model SOLAR D(Is=1u N=1.5 Rs=0.01 Eg=1.2 Cjo=1000p)
TEXT -1344 112 Left 0 !.param RS=0.05 RP=1k GS=1 TEMPSC=27
TEXT -544 112 Left 0 ;http://www.camptronic.de/Solar/Solar-Panel/BP380German.pdf

The netlist it stands for:
* solar36.asc
D9 vf9d vf8 SOLAR TEMP={TEMPSC}
RP9 vf9d vf8 {RP}
G9 vf8 vf9d sp 0 {GS}
RS9 vf9d vf9 {RS}
D8 vf8d vf7 SOLAR TEMP={TEMPSC}
RP8 vf8d vf7 {RP}
G8 vf7 vf8d sp 0 {GS}
RS8 vf8d vf8 {RS}
D7 vf7d vf6 SOLAR TEMP={TEMPSC}
RP7 vf7d vf6 {RP}
G7 vf6 vf7d sp 0 {GS}
RS7 vf7d vf7 {RS}
D6 vf6d vf5 SOLAR TEMP={TEMPSC}
RP6 vf6d vf5 {RP}
G6 vf5 vf6d sp 0 {GS}
RS6 vf6d vf6 {RS}
D18 vf18d vf17 SOLAR TEMP={TEMPSC}
RP18 vf18d vf17 {RP}
G18 vf17 vf18d sp 0 {GS}
RS18 vf18d vf18 {RS}
D17 vf17d vf16 SOLAR TEMP={TEMPSC}
RP17 vf17d vf16 {RP}
G17 vf16 vf17d sp 0 {GS}
RS17 vf17d vf17 {RS}
D16 vf16d vf15 SOLAR TEMP={TEMPSC}
RP16 vf16d vf15 {RP}
G16 vf15 vf16d sp 0 {GS}
RS16 vf16d vf16 {RS}
D15 vf15d vf14 SOLAR TEMP={TEMPSC}
RP15 vf15d vf14 {RP}
G15 vf14 vf15d sp 0 {GS}
RS15 vf15d vf15 {RS}
D5 vf5d vf4 SOLAR TEMP={TEMPSC}
RP5 vf5d vf4 {RP}
G5 vf4 vf5d sp 0 {GS}
RS5 vf5d vf5 {RS}
D4 vf4d vf3 SOLAR TEMP={TEMPSC}
RP4 vf4d vf3 {RP}
G4 vf3 vf4d sp 0 {GS}
RS4 vf4d vf4 {RS}
D3 vf3d vf2 SOLAR TEMP={TEMPSC}
RP3 vf3d vf2 {RP}
G3 vf2 vf3d sp 0 {GS}
RS3 vf3d vf3 {RS}
D2 vf2d vf1 SOLAR TEMP={TEMPSC}
RP2 vf2d vf1 {RP}
G2 vf1 vf2d sp 0 {GS}
RS2 vf2d vf2 {RS}
D14 vf14d vf13 SOLAR TEMP={TEMPSC}
RP14 vf14d vf13 {RP}
G14 vf13 vf14d sp 0 {GS}
RS14 vf14d vf14 {RS}
D13 vf13d vf12 SOLAR TEMP={TEMPSC}
RP13 vf13d vf12 {RP}
G13 vf12 vf13d sp 0 {GS}
RS13 vf13d vf13 {RS}
D12 vf12d vf11 SOLAR TEMP={TEMPSC}
RP12 vf12d vf11 {RP}
G12 vf11 vf12d sp 0 {GS}
RS12 vf12d vf12 {RS}
D11 vf11d vf10 SOLAR TEMP={TEMPSC}
RP11 vf11d vf10 {RP}
G11 vf10 vf11d sp 0 {GS}
RS11 vf11d vf11 {RS}
D27 vf27d vf26 SOLAR TEMP={TEMPSC}
RP27 vf27d vf26 {RP}
G27 vf26 vf27d sp 0 {GS}
RS27 vf27d vf27 {RS}
D26 vf26d vf25 SOLAR TEMP={TEMPSC}
RP26 vf26d vf25 {RP}
G26 vf25 vf26d sp 0 {GS}
RS26 vf26d vf26 {RS}
D25 vf25d vf24 SOLAR TEMP={TEMPSC}
RP25 vf25d vf24 {RP}
G25 vf24 vf25d sp 0 {GS}
RS25 vf25d vf25 {RS}
D24 vf24d vf23 SOLAR TEMP={TEMPSC}
RP24 vf24d vf23 {RP}
G24 vf23 vf24d sp 0 {GS}
RS24 vf24d vf24 {RS}
D36 vf36d vf35 SOLAR TEMP={TEMPSC}
RP36 vf36d vf35 {RP}
G36 vf35 vf36d sp 0 {GS}
RS36 vf36d vf36 {RS}
D35 vf35d vf34 SOLAR TEMP={TEMPSC}
RP35 vf35d vf34 {RP}
G35 vf34 vf35d sp 0 {GS}
RS35 vf35d vf35 {RS}
D34 vf34d vf33 SOLAR TEMP={TEMPSC}
RP34 vf34d vf33 {RP}
G34 vf33 vf34d sp 0 {GS}
RS34 vf34d vf34 {RS}
D33 vf33d vf32 SOLAR TEMP={TEMPSC}
RP33 vf33d vf32 {RP}
G33 vf32 vf33d sp 0 {GS}
RS33 vf33d vf33 {RS}
D23 vf23d vf22 SOLAR TEMP={TEMPSC}
RP23 vf23d vf22 {RP}
G23 vf22 vf23d sp 0 {GS}
RS23 vf23d vf23 {RS}
D22 vf22d vf21 SOLAR TEMP={TEMPSC}
RP22 vf22d vf21 {RP}
G22 vf21 vf22d sp 0 {GS}
RS22 vf22d vf22 {RS}
D21 vf21d vf20 SOLAR TEMP={TEMPSC}
RP21 vf21d vf20 {RP}
G21 vf20 vf21d sp 0 {GS}
RS21 vf21d vf21 {RS}
D20 vf20d vf19 SOLAR TEMP={TEMPSC}
RP20 vf20d vf19 {RP}
G20 vf19 vf20d sp 0 {GS}
RS20 vf20d vf20 {RS}
D32 vf32d vf31 SOLAR TEMP={TEMPSC}
RP32 vf32d vf31 {RP}
G32 vf31 vf32d sp 0 {GS}
RS32 vf32d vf32 {RS}
D31 vf31d vf30 SOLAR TEMP={TEMPSC}
RP31 vf31d vf30 {RP}
G31 vf30 vf31d sp 0 {GS}
RS31 vf31d vf31 {RS}
D30 vf30d vf29 SOLAR TEMP={TEMPSC}
RP30 vf30d vf29 {RP}
G30 vf29 vf30d sp 0 {GS}
RS30 vf30d vf30 {RS}
D29 vf29d vf28 SOLAR TEMP={TEMPSC}
RP29 vf29d vf28 {RP}
G29 vf28 vf29d sp 0 {GS}
RS29 vf29d vf29 {RS}
D1 vf1d vf0 SOLAR TEMP={TEMPSC}
RP1 vf1d vf0 {RP}
G1 vf0 vf1d sp 0 {GS}
RS1 vf1d vf1 {RS}
D10 vf10d vf9 SOLAR TEMP={TEMPSC}
RP10 vf10d vf9 {RP}
G10 vf9 vf10d sp 0 {GS}
RS10 vf10d vf10 {RS}
D19 vf19d vf18 SOLAR TEMP={TEMPSC}
RP19 vf19d vf18 {RP}
G19 vf18 vf19d sp 0 {GS}
RS19 vf19d vf19 {RS}
D28 vf28d vf27 SOLAR TEMP={TEMPSC}
RP28 vf28d vf27 {RP}
G28 vf27 vf28d sp 0 {GS}
RS28 vf28d vf28 {RS}
.model D D
.lib standard.dio
.model SOLAR D(Is=1u N=1.5 Rs=0.01 Eg=1.2 Cjo=1000p)
.param RS=0.05 RP=1k GS=1 TEMPSC=27
* http://www.camptronic.de/Solar/Solar-Panel/BP380German.pdf
.backanno
.end